# Altium schematic sheet 08 BESIDE CPU.SchDoc
size 420 x 297 mm
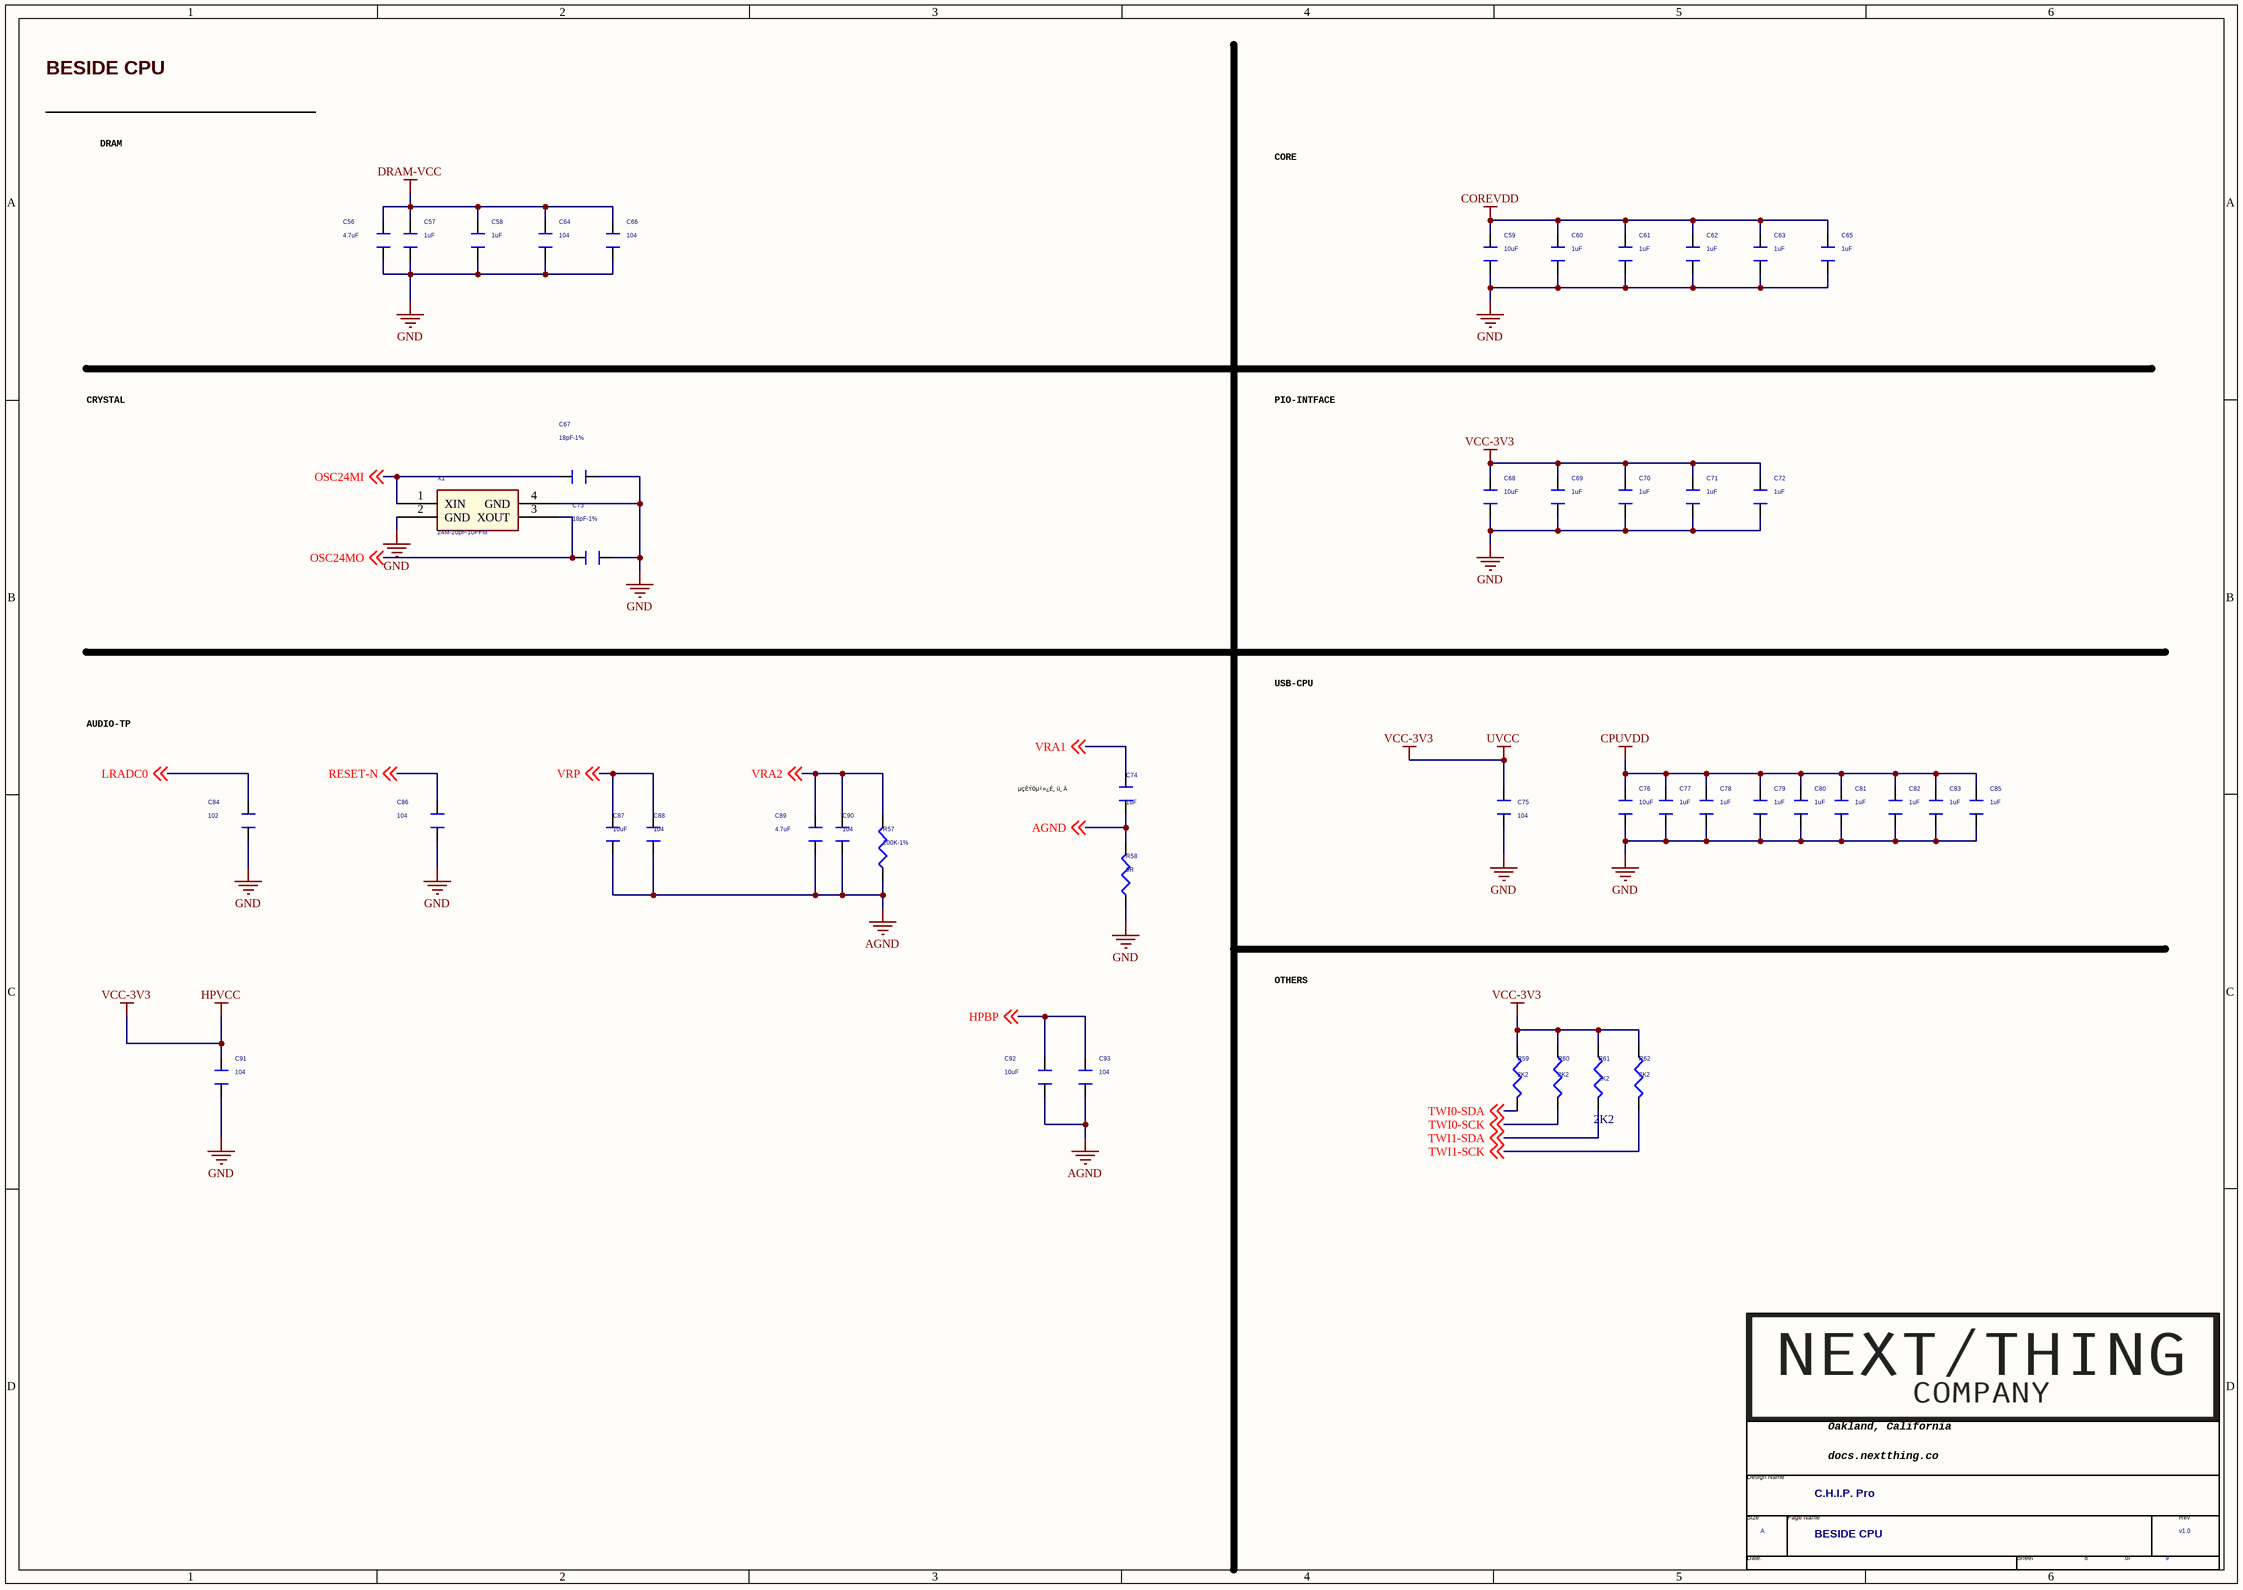
[diagram p0: 08 BESIDE CPU.SchDoc]

## Parts
*  Page Count: 9  Page Number: 8  Page Size: A  Title: C.H.I.P. Pro  RevCode: v1.0  Doc: BESIDE CPU  (hidden comment: TitleBlock1-nextthing)  (graphical)
C56  4.7uF  [C0603]
C57  1uF  [C0402]
C58  1uF  [C0402]
C59  10uF  [C0603]
C60  1uF  [C0402]
C61  1uF  [C0402]
C62  1uF  [C0402]
C63  1uF  [C0402]
C64  104  [C0201]
C65  1uF  [C0402]
C66  104  [C0201]
C67  18pF-1%  [C0201]
C68  10uF  [C0603]
C69  1uF  [C0402]
C70  1uF  [C0402]
C71  1uF  [C0402]
C72  1uF  [C0402]
C73  18pF-1%  [C0201]
C74  1uF  [C0402]
C75  104  [C0201]
C76  10uF  [C0603]
C77  1uF  [C0402]
C78  1uF  [C0402]
C79  1uF  [C0402]
C80  1uF  [C0402]
C81  1uF  [C0402]
C82  1uF  [C0402]
C83  1uF  [C0402]
C84  102  [C0201]
C85  1uF  [C0402]
C86  104  [C0201]
C87  10uF  [C0603]
C88  104  [C0201]
C89  4.7uF  [C0603]
C90  104  [C0201]
C91  104  [C0201]
C92  10uF  [C0603]
C93  104  [C0201]
R57  200K-1%  [R0201]
R58  0R  [R0201]
R59  2K2  [R0201]
R60  2K2  [R0201]
R61  2K2  [R0201]
R62  2K2  [R0201]
X1  24M-20pF-10PPM  [CRY-3225]

## Nets
AGND: C74.1 C87.1 C88.1 C89.1 C90.1 C92.1 C93.1 R57.1 R58.2 ; off-sheet AGND
COREVDD: C59.1 C60.1 C61.1 C62.1 C63.1 C65.1
CPUVDD: C76.1 C77.1 C78.1 C79.1 C80.1 C81.1 C82.1 C83.1 C85.1
DRAM-VCC: C56.2 C57.2 C58.2 C64.2 C66.2
GND: C56.1 C57.1 C58.1 C59.2 C60.2 C61.2 C62.2 C63.2 C64.1 C65.2 C66.1 C67.1 C68.2 C69.1 C70.1 C71.1 C72.1 C73.1 C75.1 C76.2 C77.2 C78.2 C79.2 C80.2 C81.2 C82.2 C83.2 C84.1 C85.2 C86.1 C91.1 R58.1 X1.2(GND) X1.4(GND)
HPVCC: C68.1 C69.2 C70.2 C71.2 C72.2 C75.2 C91.2 R59.1 R60.1 R61.1 R62.1  [also labelled UVCC, VCC-3V3]
HPBP: C92.2 C93.2 ; off-sheet HPBP
LRADC0: C84.2 ; off-sheet LRADC0
OSC24MI: C67.2 X1.1(XIN) ; off-sheet OSC24MI
OSC24MO: C73.2 X1.3(XOUT) ; off-sheet OSC24MO
RESET-N: C86.2 ; off-sheet RESET-N
TWI0-SCK: R60.2 ; off-sheet TWI0-SCK
TWI0-SDA: R59.2 ; off-sheet TWI0-SDA
TWI1-SCK: R62.2 ; off-sheet TWI1-SCK
TWI1-SDA: R61.2 ; off-sheet TWI1-SDA
VRA1: C74.2 ; off-sheet VRA1
VRA2: C89.2 C90.2 R57.2 ; off-sheet VRA2
VRP: C87.2 C88.2 ; off-sheet VRP

## Notes on the sheet
- BESIDE CPU
- DRAM
- CORE
- CRYSTAL
- PIO-INTFACE
- AUDIO-TP
- USB-CPU
- µçÈÝÖµ²»¿É¸ü¸Ä
- OTHERS
- (in symbol TitleBlock1-nextthing) Oakland, California; Design Name; docs.nextthing.co /; Size; Page Name; Rev; Date:; Sheet; of

## Library data of the parts
C56-C58 C64 C66 C67 C69-C73 C87 C92 C93 = CAPACITOR_0_Dup4: PAGE: 2
C59-C63 C65 C68 C76-C83 C85 = CAPACITOR_0_Dup3: PAGE: 1
C74 C84 C86 C88-C90 = CAPACITOR_0_Dup4
C75 C91 = CAPACITOR_0_Dup4: PAGE: 3
R57-R62 = R_Dup2
  R61: Value: 2K2
X1 = CRYSTAL-4_3: Crystal 24MHz 20pF 10ppm  -30 to +85; PART NUMBER: 7M24000004; Vendor: TXC; SPREADWIN PN: U3000019A
* = TitleBlock1-nextthing: Page Create Date: March  8, 1995